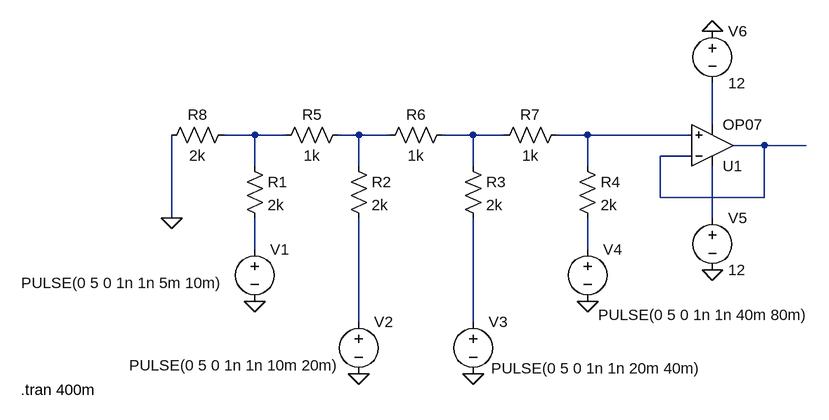
[diagram p0: schematic DAC.asc]
DAC.asc, the LTspice schematic file:
Version 4
SHEET 1 880 680
WIRE 688 80 688 16
WIRE -16 96 -64 96
WIRE 32 96 -16 96
WIRE 144 96 112 96
WIRE 192 96 144 96
WIRE 320 96 272 96
WIRE 368 96 320 96
WIRE 496 96 448 96
WIRE 656 96 496 96
WIRE 768 112 720 112
WIRE 832 112 768 112
WIRE 656 128 608 128
WIRE -16 144 -16 96
WIRE 144 144 144 96
WIRE 320 144 320 96
WIRE 496 144 496 96
WIRE 608 192 608 128
WIRE 768 192 768 112
WIRE 768 192 608 192
WIRE -144 224 -144 96
WIRE 688 224 688 144
WIRE -16 272 -16 224
WIRE 496 272 496 224
WIRE 144 384 144 224
WIRE 320 384 320 224
FLAG -16 352 0
FLAG 144 464 0
FLAG 320 464 0
FLAG 496 352 0
FLAG -144 224 0
FLAG 688 304 0
FLAG 688 -64 0
SYMBOL res -32 128 R0
SYMATTR InstName R1
SYMATTR Value 2k
SYMBOL res 128 128 R0
SYMATTR InstName R2
SYMATTR Value 2k
SYMBOL res 304 128 R0
SYMATTR InstName R3
SYMATTR Value 2k
SYMBOL res 480 128 R0
SYMATTR InstName R4
SYMATTR Value 2k
SYMBOL res 128 80 R90
WINDOW 0 0 56 VBottom 2
WINDOW 3 32 56 VTop 2
SYMATTR InstName R5
SYMATTR Value 1k
SYMBOL res 288 80 R90
WINDOW 0 0 56 VBottom 2
WINDOW 3 32 56 VTop 2
SYMATTR InstName R6
SYMATTR Value 1k
SYMBOL res 464 80 R90
WINDOW 0 0 56 VBottom 2
WINDOW 3 32 56 VTop 2
SYMATTR InstName R7
SYMATTR Value 1k
SYMBOL res -48 80 R90
WINDOW 0 0 56 VBottom 2
WINDOW 3 32 56 VTop 2
SYMATTR InstName R8
SYMATTR Value 2k
SYMBOL OpAmps\\OP07 688 176 M180
SYMATTR InstName U1
SYMBOL voltage -16 256 R0
WINDOW 3 -359 68 Left 2
WINDOW 123 0 0 Left 0
WINDOW 39 0 0 Left 0
SYMATTR InstName V1
SYMATTR Value PULSE(0 5 0 1n 1n 5m 10m)
SYMBOL voltage 144 368 R0
WINDOW 3 -353 83 Left 2
WINDOW 123 0 0 Left 0
WINDOW 39 0 0 Left 0
SYMATTR InstName V2
SYMATTR Value PULSE(0 5 0 1n 1n 10m 20m)
SYMBOL voltage 320 368 R0
WINDOW 3 28 87 Left 2
WINDOW 123 0 0 Left 0
WINDOW 39 0 0 Left 0
SYMATTR InstName V3
SYMATTR Value PULSE(0 5 0 1n 1n 20m 40m)
SYMBOL voltage 496 256 R0
WINDOW 3 16 117 Left 2
WINDOW 123 0 0 Left 0
WINDOW 39 0 0 Left 0
SYMATTR InstName V4
SYMATTR Value PULSE(0 5 0 1n 1n 40m 80m)
SYMBOL voltage 688 208 R0
WINDOW 123 0 0 Left 0
WINDOW 39 0 0 Left 0
SYMATTR InstName V5
SYMATTR Value 12
SYMBOL voltage 688 -80 R0
WINDOW 123 0 0 Left 0
WINDOW 39 0 0 Left 0
SYMATTR InstName V6
SYMATTR Value 12
TEXT -376 488 Left 2 !.tran 400m

The netlist it stands for:
* DAC.asc
R1 N002 N008 2k
R2 N003 N010 2k
R3 N004 N011 2k
R4 N005 N009 2k
R5 N003 N002 1k
R6 N004 N003 1k
R7 N005 N004 1k
R8 N002 0 2k
XU1 N005 N006 N007 N001 N006 LT1001  ; OP07, pins In+ In- V+ V- OUT
V1 N008 0 PULSE(0 5 0 1n 1n 5m 10m)
V2 N010 0 PULSE(0 5 0 1n 1n 10m 20m)
V3 N011 0 PULSE(0 5 0 1n 1n 20m 40m)
V4 N009 0 PULSE(0 5 0 1n 1n 40m 80m)
V5 N007 0 12
V6 0 N001 12
.tran 400m
.lib LTC.lib
.backanno
.end